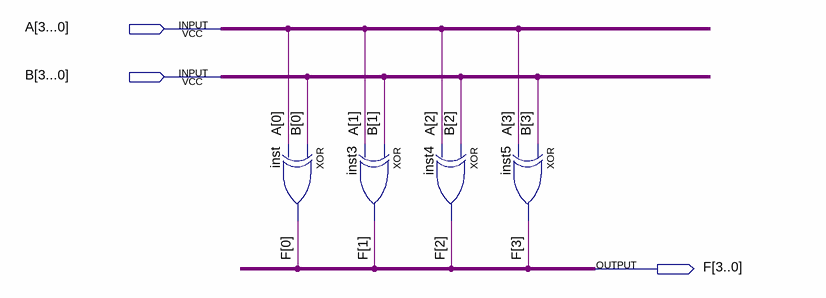
[diagram p0: schematic sheet]
// Quartus schematic Xor.bdf as structural Verilog: 4 symbols, 3 pins
module Xor (
  input  \A[3...0] ,
  input  \B[3...0] ,
  output [3:0] F
);

  wire [3:0] A, B;

  xor inst (F[0], B[0], A[0]);
  xor inst3 (F[1], B[1], A[1]);
  xor inst4 (F[2], B[2], A[2]);
  xor inst5 (F[3], B[3], A[3]);
endmodule
